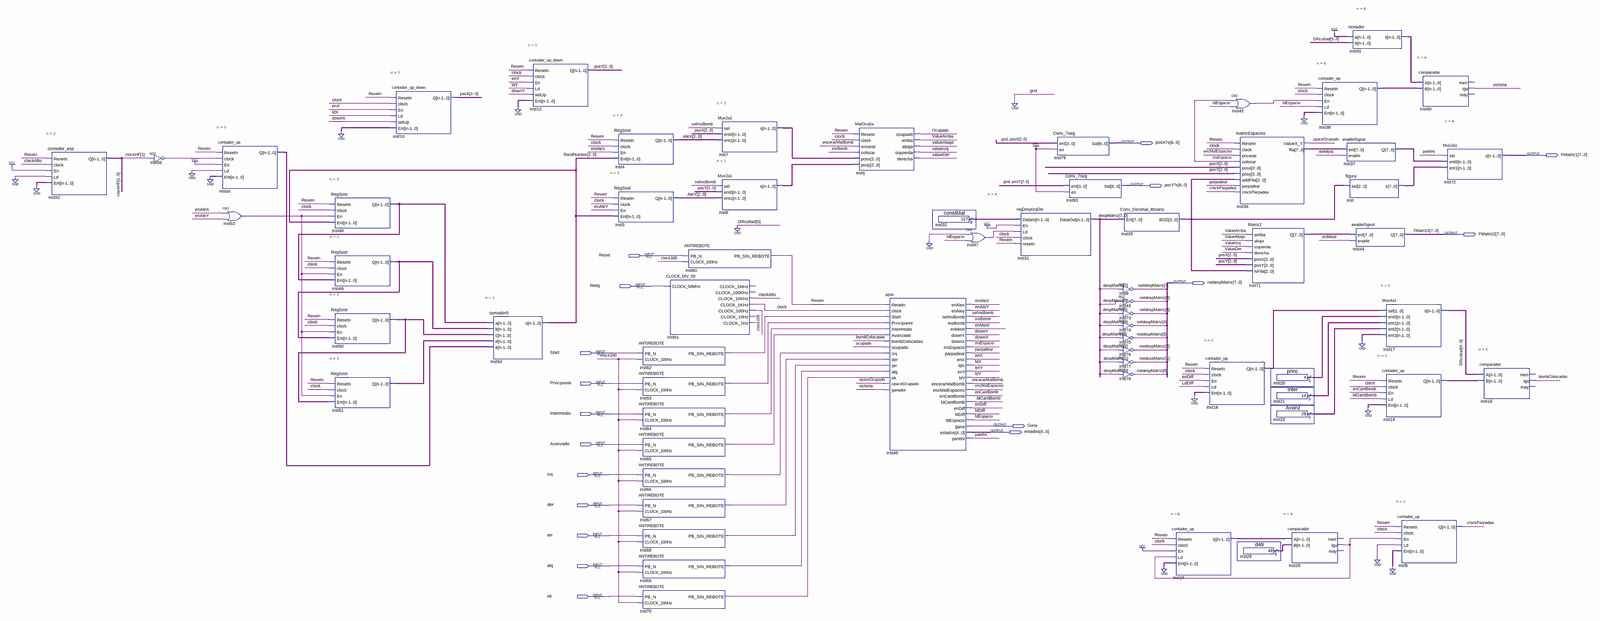
[diagram p0: schematic sheet, whole]
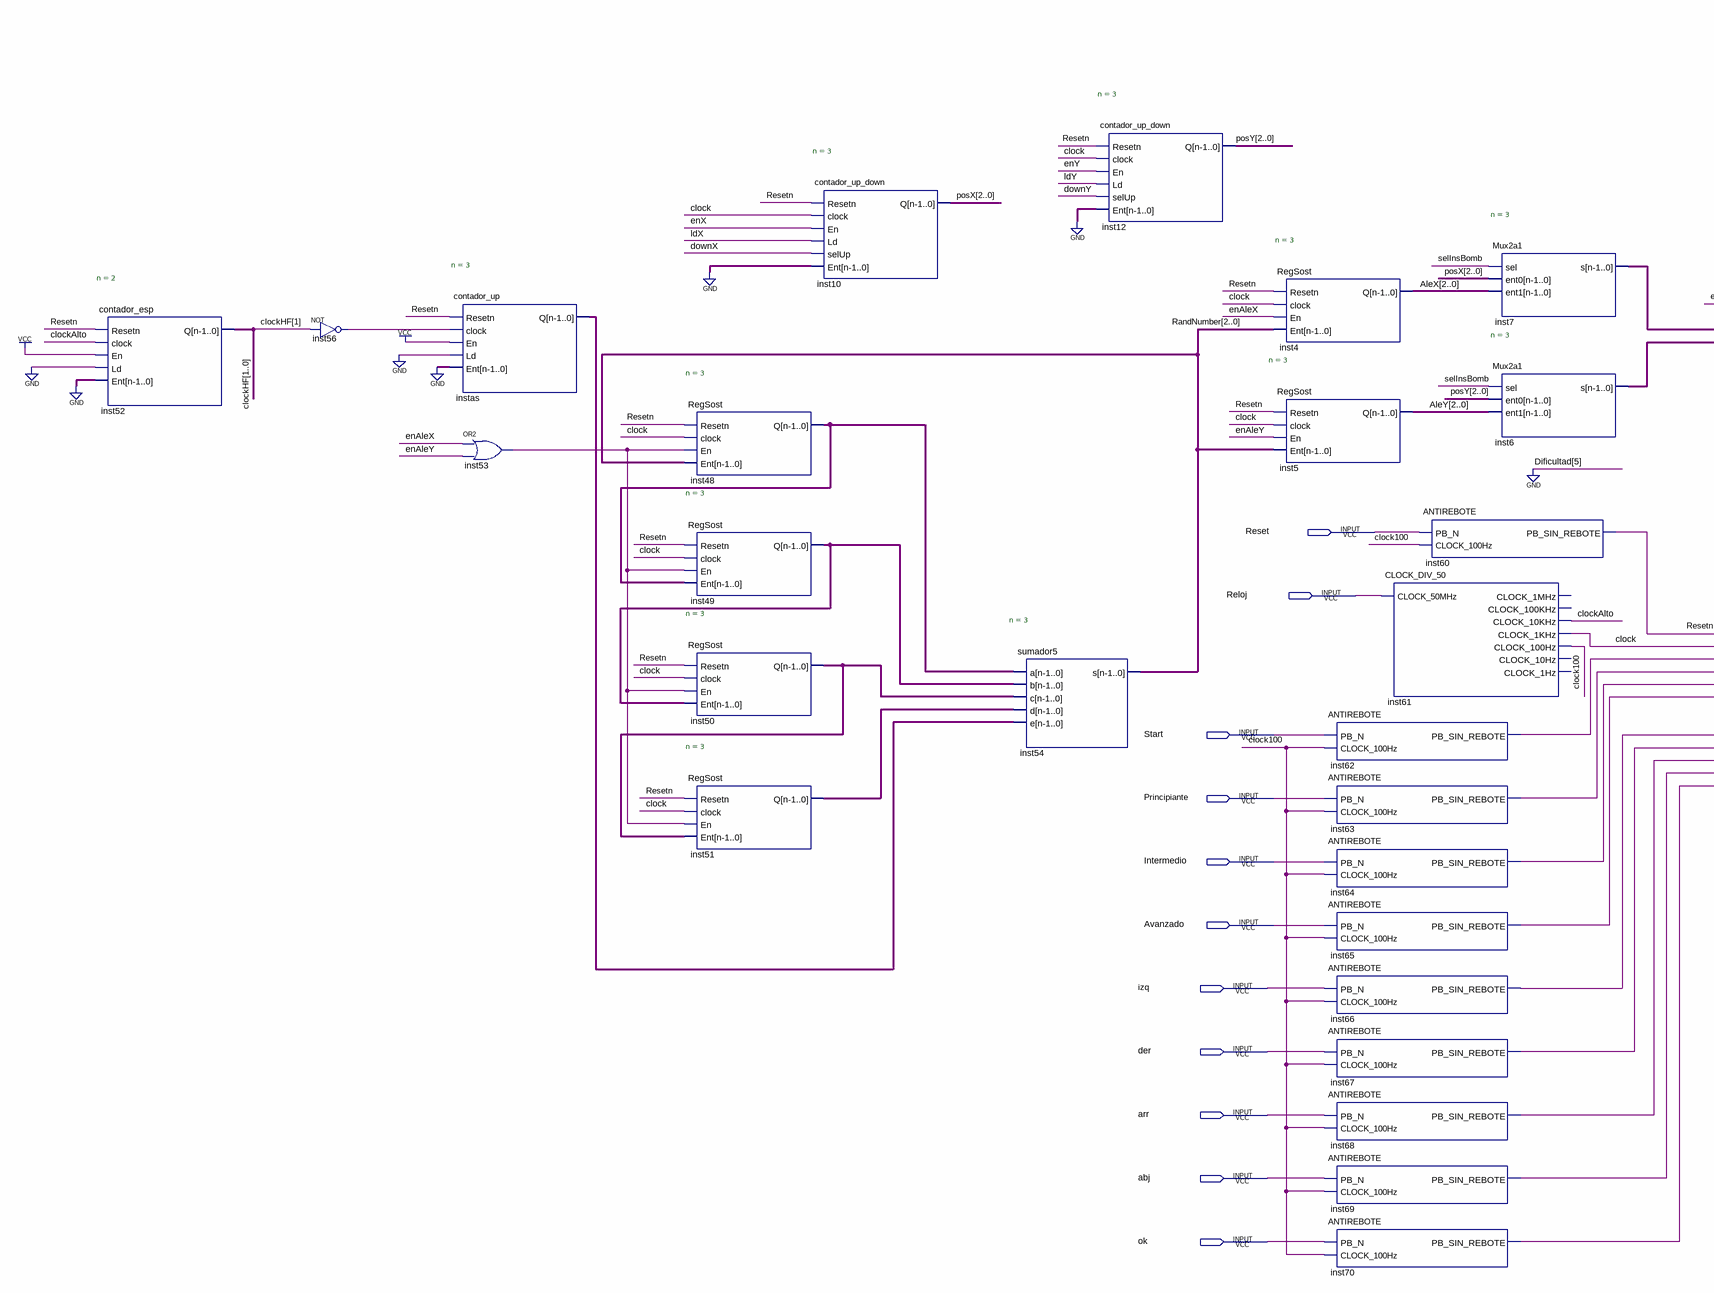
[diagram p1: schematic sheet, left part]
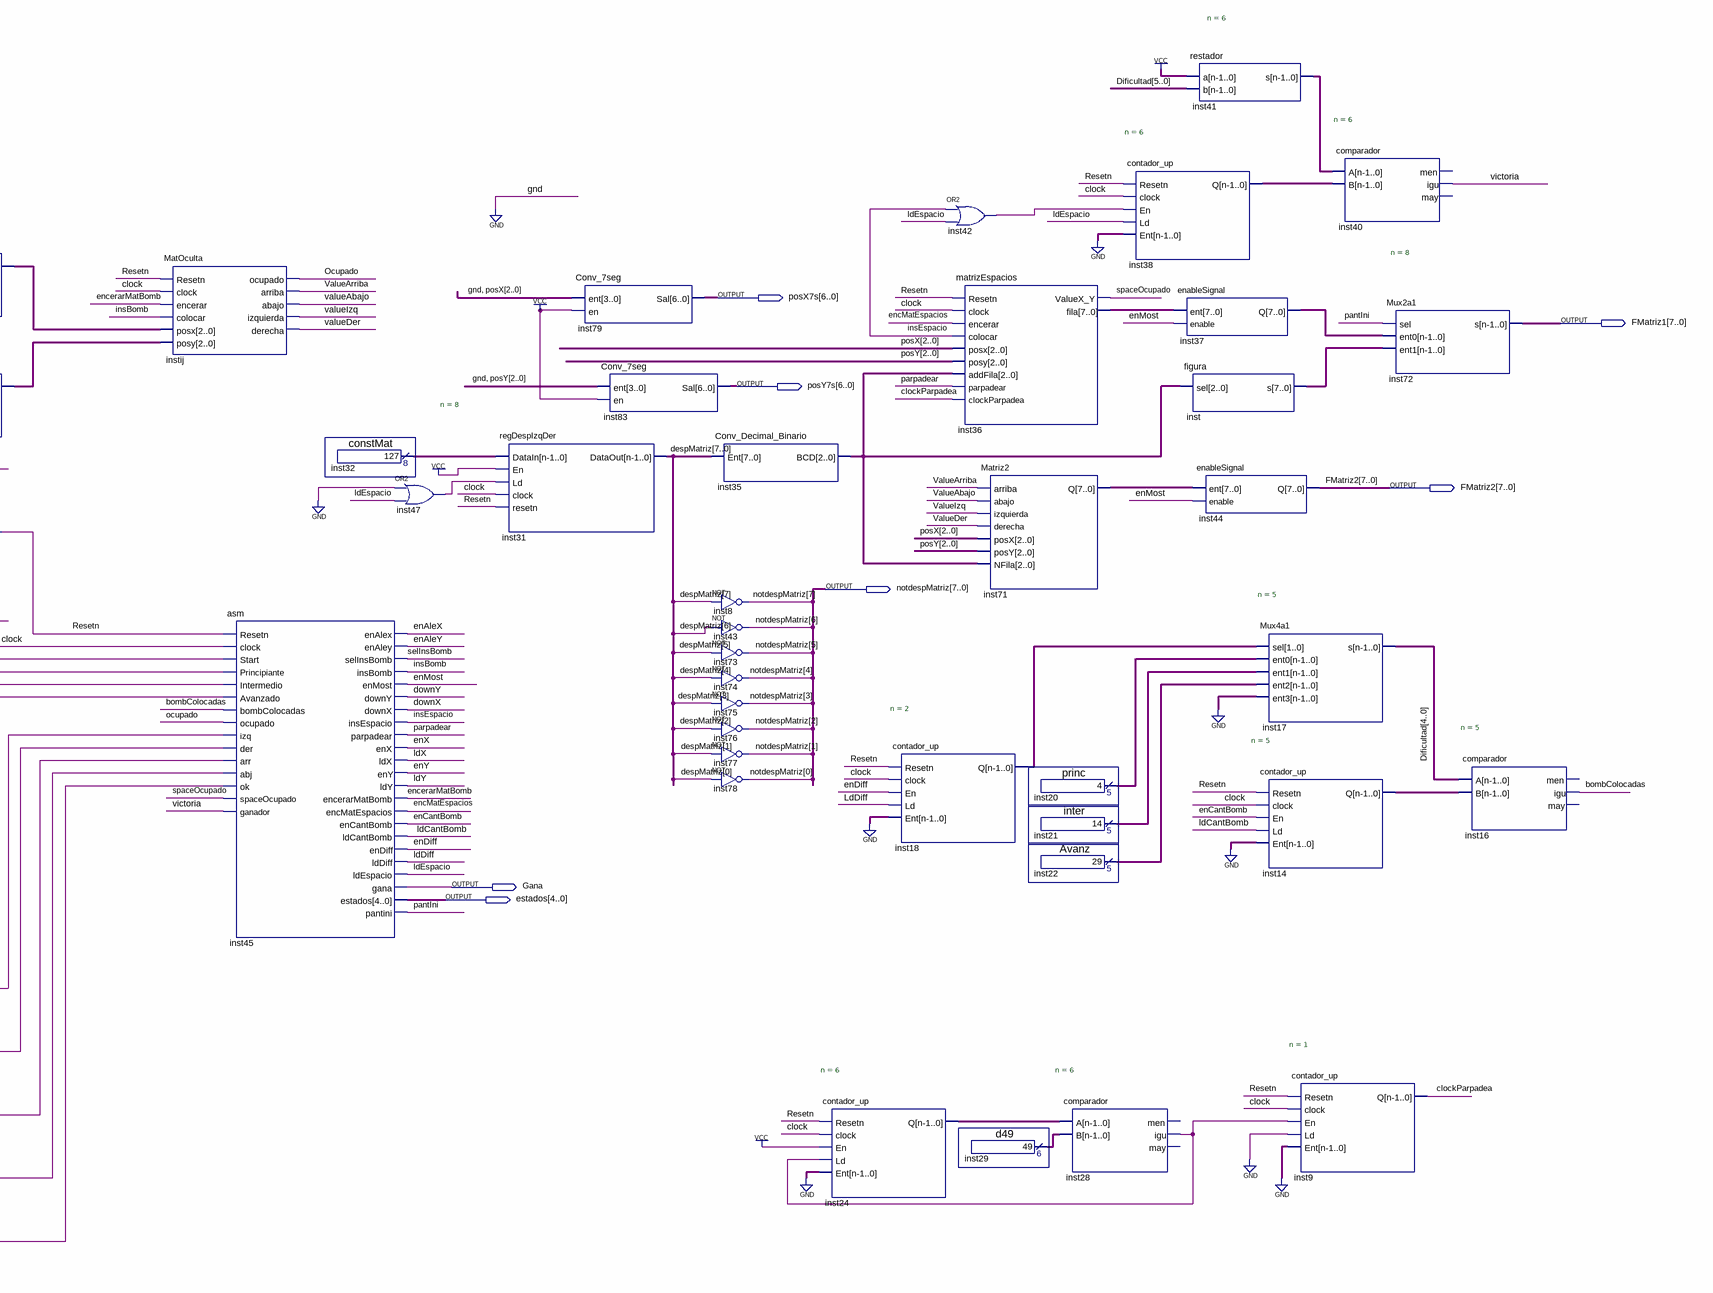
[diagram p2: schematic sheet, right part]
// Quartus schematic Buscamina.bdf as structural Verilog: 63 symbols, 18 pins
module Buscamina (
  input  Reset,
  input  Reloj,
  input  Start,
  input  Principiante,
  input  Intermedio,
  input  Avanzado,
  input  izq,
  input  der,
  input  arr,
  input  abj,
  input  ok,
  output [6:0] posX7s,
  output [7:0] FMatriz1,
  output [6:0] posY7s,
  output [7:0] FMatriz2,
  output [7:0] notdespMatriz,
  output Gana,
  output [4:0] estados
);

  wire bombColocadas, clock, clock100, clockAlto, clockParpadea, downX, downY, enAleX, enAleY, enCantBomb,
       encerarMatBomb, encMatEspacios, enDiff, enMost, enX, enY, insBomb, insEspacio, inst28_igu, inst42_out,
       inst47_out, inst53_out, inst56_out, inst62_pb_sin_rebote, inst63_pb_sin_rebote, inst64_pb_sin_rebote,
       inst65_pb_sin_rebote, inst66_pb_sin_rebote, inst67_pb_sin_rebote, inst68_pb_sin_rebote,
       inst69_pb_sin_rebote, inst70_pb_sin_rebote, ldCantBomb, ldDiff, ldEspacio, ldX, ldY, ocupado, pantIni,
       parpadear, Resetn, selInsBomb, spaceOcupado, ValueAbajo, ValueArriba, ValueDer, ValueIzq, victoria;
  wire [1:0] clockHF, inst18_q;
  wire [2:0] AleX, AleY, inst6_s, inst7_s, inst35_bcd, inst48_q, inst49_q, inst50_q, inst51_q, instas_q,
       posX, posY, RandNumber;
  wire [4:0] Dificultad, inst14_q, inst20_result, inst21_result, inst22_result;
  wire [5:0] inst24_q, inst29_result, inst38_q, inst41_s;
  wire [7:0] despMatriz, inst32_result, inst36_fila, inst37_q, inst71_q, inst_s;

  contador_esp #(.n(2)) inst52 (.Resetn(Resetn), .clock(clockAlto), .En(1'b1), .Ld(1'b0), .Ent(2'b00), .Q(clockHF));
  not inst56 (inst56_out, clockHF[1]);
  contador_up #(.n(3)) instas (.Resetn(Resetn), .clock(inst56_out), .En(1'b1), .Ld(1'b0), .Ent(3'b000), .Q(instas_q));
  or inst53 (inst53_out, enAleX, enAleY);
  RegSost #(.n(3)) inst48 (.Resetn(Resetn), .clock(clock), .En(inst53_out), .Ent(RandNumber), .Q(inst48_q));
  RegSost #(.n(3)) inst49 (.Resetn(Resetn), .clock(clock), .En(inst53_out), .Ent(inst48_q), .Q(inst49_q));
  RegSost #(.n(3)) inst50 (.Resetn(Resetn), .clock(clock), .En(inst53_out), .Ent(inst49_q), .Q(inst50_q));
  RegSost #(.n(3)) inst51 (.Resetn(Resetn), .clock(clock), .En(inst53_out), .Ent(inst50_q), .Q(inst51_q));
  contador_up_down #(.n(3)) inst10 (
    .Resetn(Resetn), .clock(clock), .En(enX), .Ld(ldX), .selUp(downX), .Ent(3'b000), .Q(posX));
  sumador5 #(.n(3)) inst54 (.a(inst48_q), .b(inst49_q), .c(inst50_q), .d(inst51_q), .e(instas_q), .s(RandNumber));
  contador_up_down #(.n(3)) inst12 (
    .Resetn(Resetn), .clock(clock), .En(enY), .Ld(ldY), .selUp(downY), .Ent(3'b000), .Q(posY));
  RegSost #(.n(3)) inst4 (.Resetn(Resetn), .clock(clock), .En(enAleX), .Ent(RandNumber), .Q(AleX));
  RegSost #(.n(3)) inst5 (.Resetn(Resetn), .clock(clock), .En(enAleY), .Ent(RandNumber), .Q(AleY));
  ANTIREBOTE inst62 (.PB_N(Start), .CLOCK_100Hz(clock100), .PB_SIN_REBOTE(inst62_pb_sin_rebote));
  ANTIREBOTE inst63 (.PB_N(Principiante), .CLOCK_100Hz(clock100), .PB_SIN_REBOTE(inst63_pb_sin_rebote));
  ANTIREBOTE inst64 (.PB_N(Intermedio), .CLOCK_100Hz(clock100), .PB_SIN_REBOTE(inst64_pb_sin_rebote));
  ANTIREBOTE inst65 (.PB_N(Avanzado), .CLOCK_100Hz(clock100), .PB_SIN_REBOTE(inst65_pb_sin_rebote));
  ANTIREBOTE inst66 (.PB_N(izq), .CLOCK_100Hz(clock100), .PB_SIN_REBOTE(inst66_pb_sin_rebote));
  ANTIREBOTE inst67 (.PB_N(der), .CLOCK_100Hz(clock100), .PB_SIN_REBOTE(inst67_pb_sin_rebote));
  ANTIREBOTE inst68 (.PB_N(arr), .CLOCK_100Hz(clock100), .PB_SIN_REBOTE(inst68_pb_sin_rebote));
  ANTIREBOTE inst69 (.PB_N(abj), .CLOCK_100Hz(clock100), .PB_SIN_REBOTE(inst69_pb_sin_rebote));
  ANTIREBOTE inst70 (.PB_N(ok), .CLOCK_100Hz(clock100), .PB_SIN_REBOTE(inst70_pb_sin_rebote));
  CLOCK_DIV_50 inst61 (
    .CLOCK_50MHz(Reloj), .CLOCK_10KHz(clockAlto), .CLOCK_1KHz(clock), .CLOCK_100Hz(clock100));  // open: CLOCK_1MHz, CLOCK_100KHz, CLOCK_10Hz, CLOCK_1Hz
  ANTIREBOTE inst60 (.PB_N(Reset), .CLOCK_100Hz(clock100), .PB_SIN_REBOTE(Resetn));
  Mux2a1 #(.n(3)) inst7 (.sel(selInsBomb), .ent0(posX), .ent1(AleX), .s(inst7_s));
  Mux2a1 #(.n(3)) inst6 (.sel(selInsBomb), .ent0(posY), .ent1(AleY), .s(inst6_s));
  MatOculta instij (
    .Resetn(Resetn), .clock(clock), .encerar(encerarMatBomb), .colocar(insBomb), .posx(inst7_s),
    .posy(inst6_s), .ocupado(ocupado), .arriba(ValueArriba), .abajo(ValueAbajo), .izquierda(ValueIzq),
    .derecha(ValueDer));
  asm inst45 (
    .Resetn(Resetn), .clock(clock), .Start(inst62_pb_sin_rebote), .Principiante(inst63_pb_sin_rebote),
    .Intermedio(inst64_pb_sin_rebote), .Avanzado(inst65_pb_sin_rebote), .bombColocadas(bombColocadas),
    .ocupado(ocupado), .izq(inst66_pb_sin_rebote), .der(inst67_pb_sin_rebote), .arr(inst68_pb_sin_rebote),
    .abj(inst69_pb_sin_rebote), .ok(inst70_pb_sin_rebote), .spaceOcupado(spaceOcupado), .ganador(victoria),
    .enAlex(enAleX), .enAley(enAleY), .selInsBomb(selInsBomb), .insBomb(insBomb), .enMost(enMost),
    .downY(downY), .downX(downX), .insEspacio(insEspacio), .parpadear(parpadear), .enX(enX), .ldX(ldX),
    .enY(enY), .ldY(ldY), .encerarMatBomb(encerarMatBomb), .encMatEspacios(encMatEspacios),
    .enCantBomb(enCantBomb), .ldCantBomb(ldCantBomb), .enDiff(enDiff), .ldDiff(ldDiff),
    .ldEspacio(ldEspacio), .gana(Gana), .estados(estados), .pantini(pantIni));
  constMat inst32 (.result(inst32_result));
  or inst47 (inst47_out, 1'b0, ldEspacio);
  regDespIzqDer #(.n(8)) inst31 (
    .DataIn(inst32_result), .En(1'b1), .Ld(inst47_out), .clock(clock), .resetn(Resetn), .DataOut(despMatriz));
  Conv_7seg inst79 (.ent({1'b0, posX}), .en(1'b1), .Sal(posX7s));
  Conv_7seg inst83 (.ent({1'b0, posY}), .en(1'b1), .Sal(posY7s));
  Conv_Decimal_Binario inst35 (.Ent(despMatriz), .BCD(inst35_bcd));
  not inst8 (notdespMatriz[7], despMatriz[7]);
  not inst43 (notdespMatriz[6], despMatriz[6]);
  not inst73 (notdespMatriz[5], despMatriz[5]);
  not inst74 (notdespMatriz[4], despMatriz[4]);
  not inst75 (notdespMatriz[3], despMatriz[3]);
  not inst76 (notdespMatriz[2], despMatriz[2]);
  not inst77 (notdespMatriz[1], despMatriz[1]);
  not inst78 (notdespMatriz[0], despMatriz[0]);
  contador_up #(.n(6)) inst24 (
    .Resetn(Resetn), .clock(clock), .En(1'b1), .Ld(inst28_igu), .Ent({6{1'b0}}), .Q(inst24_q));
  contador_up #(.n(2)) inst18 (.Resetn(Resetn), .clock(clock), .En(enDiff), .Ld(ldDiff), .Ent(2'b00), .Q(inst18_q));
  or inst42 (inst42_out, insEspacio, ldEspacio);
  matrizEspacios inst36 (
    .Resetn(Resetn), .clock(clock), .encerar(encMatEspacios), .colocar(insEspacio), .posx(posX), .posy(posY),
    .addFila(inst35_bcd), .parpadear(parpadear), .clockParpadea(clockParpadea), .ValueX_Y(spaceOcupado),
    .fila(inst36_fila));
  Matriz2 inst71 (
    .arriba(ValueArriba), .abajo(ValueAbajo), .izquierda(ValueIzq), .derecha(ValueDer), .posX(posX),
    .posY(posY), .NFila(inst35_bcd), .Q(inst71_q));
  d49 inst29 (.result(inst29_result));
  princ inst20 (.result(inst20_result));
  inter inst21 (.result(inst21_result));
  Avanz inst22 (.result(inst22_result));
  comparador #(.n(6)) inst28 (.A(inst24_q), .B(inst29_result), .igu(inst28_igu));  // open: men, may
  contador_up #(.n(6)) inst38 (
    .Resetn(Resetn), .clock(clock), .En(inst42_out), .Ld(ldEspacio), .Ent({6{1'b0}}), .Q(inst38_q));
  restador #(.n(6)) inst41 (.a({6{1'b1}}), .b({1'b0, Dificultad}), .s(inst41_s));
  enableSignal inst37 (.ent(inst36_fila), .enable(enMost), .Q(inst37_q));
  figura inst (.sel(inst35_bcd), .s(inst_s));
  enableSignal inst44 (.ent(inst71_q), .enable(enMost), .Q(FMatriz2));
  Mux4a1 #(.n(5)) inst17 (
    .sel(inst18_q), .ent0(inst20_result), .ent1(inst21_result), .ent2(inst22_result), .ent3({5{1'b0}}),
    .s(Dificultad));
  contador_up #(.n(5)) inst14 (
    .Resetn(Resetn), .clock(clock), .En(enCantBomb), .Ld(ldCantBomb), .Ent({5{1'b0}}), .Q(inst14_q));
  contador_up #(.n(1)) inst9 (
    .Resetn(Resetn), .clock(clock), .En(inst28_igu), .Ld(1'b0), .Ent(1'b0), .Q(clockParpadea));
  comparador #(.n(6)) inst40 (.A(inst41_s), .B(inst38_q), .igu(victoria));  // open: men, may
  Mux2a1 #(.n(8)) inst72 (.sel(pantIni), .ent0(inst37_q), .ent1(inst_s), .s(FMatriz1));
  comparador #(.n(5)) inst16 (.A(Dificultad), .B(inst14_q), .igu(bombColocadas));  // open: men, may
endmodule
